# Altium schematic sheet MCU.SchDoc
size A4
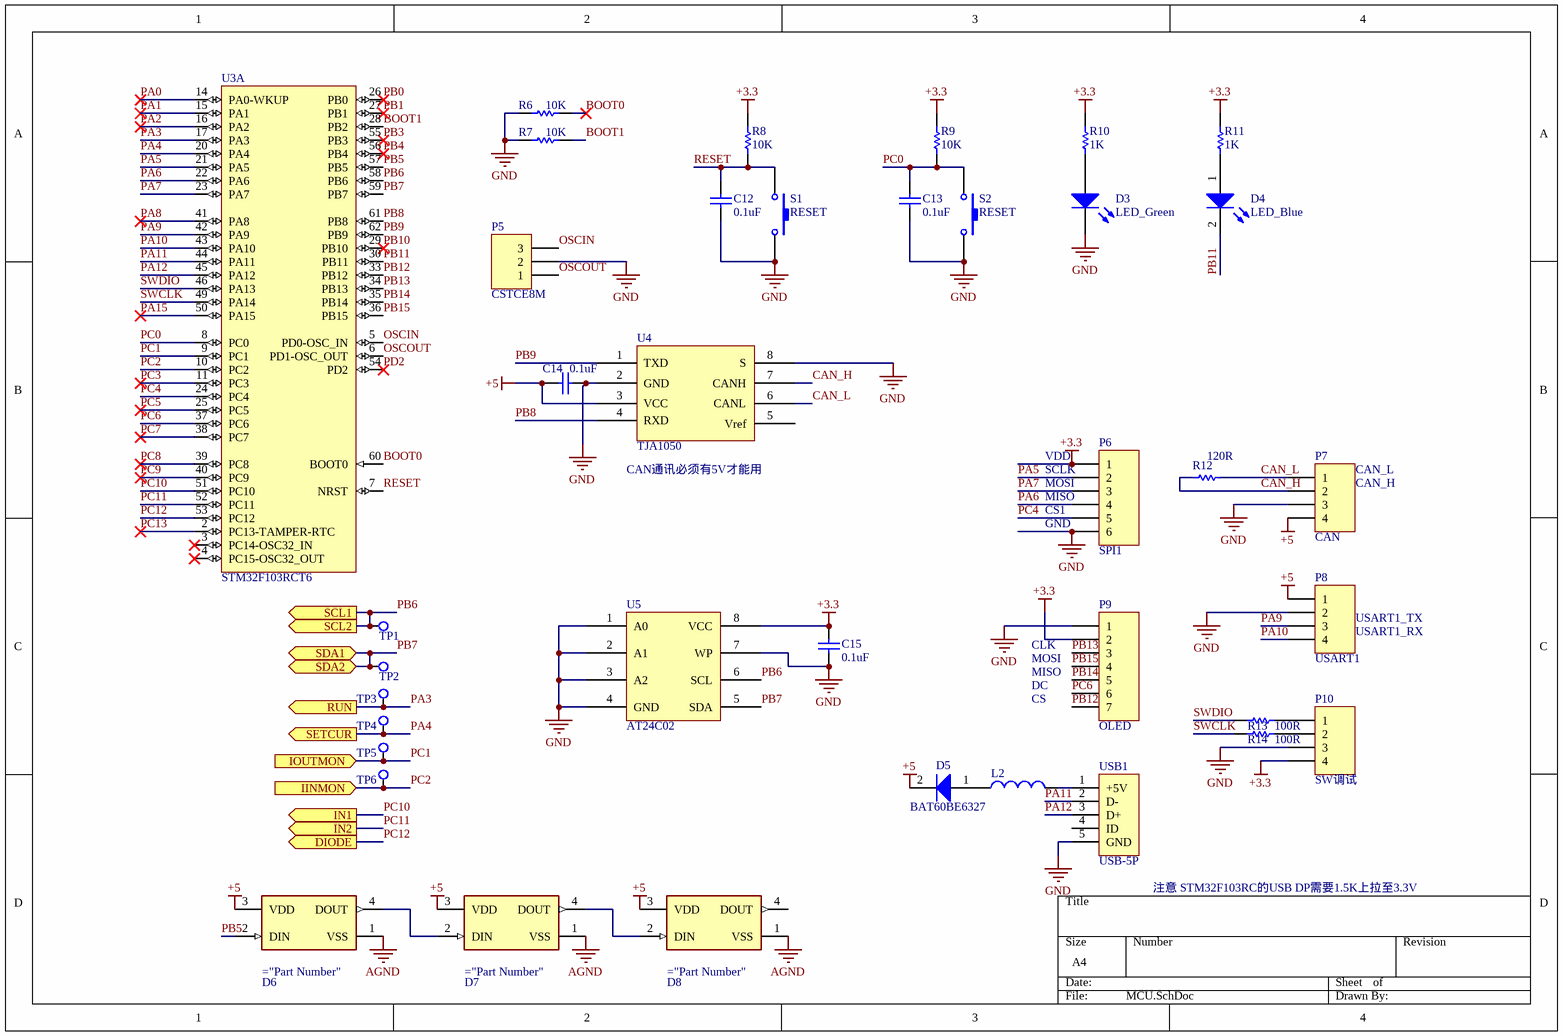
[diagram p0: MCU.SchDoc]

## Parts
C12  value 0.1uF  [0603C]  (hidden comment: Cap)
C13  value 0.1uF  [0603C]  (hidden comment: Cap)
C14  value 0.1uF  [0603C]  (hidden comment: Cap)
C15  value 0.1uF  [0603C]  (hidden comment: Cap)
D3  LED_Green  [LED 0603B]
D4  LED_Blue  [LED 0603B]
D5  BAT60BE6327  [SOD-523]
D6  WS2812  [Adafruit_1655_0]  (value not drawn)
D7  WS2812  [Adafruit_1655_0]  (value not drawn)
D8  WS2812  [Adafruit_1655_0]  (value not drawn)
L2  Inductor  [L 0603]  (value not drawn)
P5  CSTCE8M  [CSTCE16M]
P6  SPI1  [MX 1.25-WS-6P]
P7  CAN  [SM04B]
P8  USART1  [SM04B]
P9  OLED  [HDR2.54-M-LI-7P]
P10  SW调试  [53261]
R6  value 10K  [0603R]  (hidden comment: Res1)
R7  value 10K  [0603R]  (hidden comment: Res1)
R8  value 10K  [0603R]  (hidden comment: Res1)
R9  value 10K  [0603R]  (hidden comment: Res1)
R10  value 1K  [0603R]  (hidden comment: Res1)
R11  value 1K  [0603R]  (hidden comment: Res1)
R12  value 120R  [0603R]  (hidden comment: Res1)
R13  value 100R  [0603R]  (hidden comment: Res1)
R14  value 100R  [0603R]  (hidden comment: Res1)
S1  RESET  [TSW SMD-3*6*2.5]
S2  RESET  [TSW SMD-3*6*2.5]
TP1  TestPoint  [TP_Black(1.6mm)]  (value not drawn)
TP2  TestPoint  [TP_Black(1.6mm)]  (value not drawn)
TP3  TestPoint  [TP_Black(1.6mm)]  (value not drawn)
TP4  TestPoint  [TP_Black(1.6mm)]  (value not drawn)
TP5  TestPoint  [TP_Black(1.6mm)]  (value not drawn)
TP6  TestPoint  [TP_Black(1.6mm)]  (value not drawn)
U3  STM32F103RCT6  [STM-LQFP64_N]  (part A of 2)
U4  TJA1050  [SO8]
U5  AT24C02  [SOP8]
USB1  USB-5P  [USB-MICRO_E]

## Ports
DIODE (out), IINMON (in), IN1 (out), IN2 (out), IOUTMON (in), RUN (out), SCL1 (out), SCL2 (out), SDA1 (bidir), SDA2 (bidir), SETCUR (out)

## Nets
+3.3: C15.1 P6.1 P9.2 P10.4 R8.2 R9.2 R10.2 R11.2 U5.8(VCC)
+5: C14.2 D5.2(K) D6.3(VDD) D7.3(VDD) D8.3(VDD) P7.4 P8.1 U4.3(VCC)
AGND: D6.1(VSS) D7.1(VSS) D8.1(VSS)
GND: C12.1 C13.1 C14.1 C15.2 D3.2(K) P5.2 P6.6 P7.3 P8.2 P9.1 P10.3 R6.1 R7.1 S1.2 S2.2 U4.2(GND) U4.8(S) U5.1(A0) U5.2(A1) U5.3(A2) U5.4(GND) U5.7(WP) USB1.5(GND)
BOOT0: R6.2 U3.60(BOOT0)
BOOT1: R7.2 U3.28(PB2)
CAN_H: P7.2 R12.1 U4.7(CANH)
CAN_L: P7.1 R12.2 U4.6(CANL)
OSCIN: P5.3 U3.5(PD0-OSC_IN)
OSCOUT: P5.1 U3.6(PD1-OSC_OUT)
PA0: U3.14(PA0-WKUP)
PA1: U3.15(PA1)
PA2: U3.16(PA2)
PA3: TP3.1(VSS) U3.17(PA3) ; port RUN
PA4: TP4.1(VSS) U3.20(PA4) ; port SETCUR
PA5: P6.2 U3.21(PA5)
PA6: P6.4 U3.22(PA6)
PA7: P6.3 U3.23(PA7)
PA8: U3.41(PA8)
PA9: P8.3 U3.42(PA9)
PA10: P8.4 U3.43(PA10)
PA11: U3.44(PA11) USB1.2(D-)
PA12: U3.45(PA12) USB1.3(D+)
PA15: U3.50(PA15)
PB0: U3.26(PB0)
PB1: U3.27(PB1)
PB3: U3.55(PB3)
PB4: U3.56(PB4)
PB5: D6.2(DIN) U3.57(PB5)
PB6: TP1.1(VSS) U3.58(PB6) U5.6(SCL) ; port SCL2, port SCL1
PB7: TP2.1(VSS) U3.59(PB7) U5.5(SDA) ; port SDA1, port SDA2
PB8: U3.61(PB8) U4.4(RXD)
PB9: U3.62(PB9) U4.1(TXD)
PB10: U3.29(PB10)
PB11: D4.2(K) U3.30(PB11)
PB12: P9.7 U3.33(PB12)
PB13: P9.3 U3.34(PB13)
PB14: P9.5 U3.35(PB14)
PB15: P9.4 U3.36(PB15)
PC0: C13.2 R9.1 S2.1 U3.8(PC0)
PC1: TP5.1(VSS) U3.9(PC1) ; port IOUTMON
PC2: TP6.1(VSS) U3.10(PC2) ; port IINMON
PC3: U3.11(PC3)
PC4: P6.5 U3.24(PC4)
PC5: U3.25(PC5)
PC6: P9.6 U3.37(PC6)
PC7: U3.38(PC7)
PC8: U3.39(PC8)
PC9: U3.40(PC9)
PC10: U3.51(PC10) ; port IN1
PC11: U3.52(PC11) ; port IN2
PC12: U3.53(PC12) ; port DIODE
PC13: U3.2(PC13-TAMPER-RTC)
PD2: U3.54(PD2)
RESET: C12.2 R8.1 S1.1 U3.7(NRST)
SWCLK: R14.1 U3.49(PA14)
SWDIO: R13.1 U3.46(PA13)
NetD3_1: D3.1(A) R10.1
NetD4_1: D4.1(A) R11.1
NetD5_1: D5.1(A) L2.1
NetD6_4: D6.4(DOUT) D7.2(DIN)
NetD7_4: D7.4(DOUT) D8.2(DIN)
NetL2_2: L2.2 USB1.1(+5V)
NetP10_1: P10.1 R13.2
NetP10_2: P10.2 R14.2

Not connected (* = marked no-connect by the designer): D8 4(DOUT); U3 3(PC14-OSC32_IN)* 4(PC15-OSC32_OUT)*; U4 5(Vref); USB1 4(ID)

## Notes on the sheet
- (near U4) CAN通讯必须有5V才能用
- (near P6) VDD
- (near P6) SCLK
- (near P6) MOSI
- (near P6) MISO
- (near P6) CS1
- (near P7) CAN_L
- (near P7) CAN_H
- (near P6) GND
- (near P9) CLK
- (near P8) USART1_TX
- (near P8) USART1_RX
- CS
- DC
- (near P9) MISO
- (near P9) MOSI
- 注意 STM32F103RC的USB DP需要1.5K上拉至3.3V

## Library data of the parts
C12-C15 = Cap: X5R 50V; Published: 8-Jun-2000; LatestRevisionDate: 17-Jul-2002; LatestRevisionNote: Re-released for DXP Platform.; PackageReference: RAD-0.3; Publisher: Altium Limited; PackageDescription: Radial Cap, Thru-Hole; 2 Leads; 0.3 in Pin Spacing
D3 = LED0: Green; Published: 8-Jun-2000; LatestRevisionDate: 08-Jul-2005; LatestRevisionNote: Mech Layer 1 removed.; PackageReference: LED-0; Publisher: Altium Limited; PackageDescription: LED; 2 Leads
D4 = LED0: Blue; Published: 8-Jun-2000; LatestRevisionDate: 08-Jul-2005; LatestRevisionNote: Mech Layer 1 removed.; PackageReference: LED-0; Publisher: Altium Limited; PackageDescription: LED; 2 Leads
D5 = Diode: Published: 8-Jun-2000; LatestRevisionDate: 17-Jul-2002; LatestRevisionNote: Re-released for DXP Platform.; PackageVersion: Sep-1996; PackageReference: SMC; Publisher: Altium Limited; PackageDescription: DO-214-AB/SMC; 2 C-Bend Leads; Body 7.9 x 5.9 mm, inc. leads (LxW); Code_JEDEC: DO-214-AB
D6-D8 = WS2812: RGB LED
L2 = Inductor: MPZ1608S181ATAH0; Code_IEC: 1005; Value: mH; Published: 8-Jun-2000; LatestRevisionDate: 29-May-2009; LatestRevisionNote: IPC-7351 Footprint Added.; PackageReference: 0402-A; Publisher: Altium Limited; PackageDescription: Chip Inductor; Code_JEITA: 0402
P5 = Header 3: Header, 3-Pin; LatestRevisionDate: 17-Jul-2002; LatestRevisionNote: Re-released for DXP Platform.; Publisher: Altium Limited
P6 = Header 6: Header, 6-Pin; LatestRevisionDate: 17-Jul-2002; LatestRevisionNote: Re-released for DXP Platform.; Publisher: Altium Limited
P7 P8 = Header 4: Header, 4-Pin; LatestRevisionDate: 17-Jul-2002; LatestRevisionNote: Re-released for DXP Platform.; Publisher: Altium Limited
P9 = Header 7: OLED Connector 7P杜邦母头; LatestRevisionDate: 17-Jul-2002; LatestRevisionNote: Re-released for DXP Platform.; Publisher: Altium Limited
P10 = Header 4: Connector MX1.25 4P; LatestRevisionDate: 17-Jul-2002; LatestRevisionNote: Re-released for DXP Platform.; Publisher: Altium Limited
R6-R14 = Res1: Resistor; Published: 8-Jun-2000; LatestRevisionDate: 17-Jul-2002; LatestRevisionNote: Re-released for DXP Platform.; PackageReference: AXIAL-0.3; Publisher: Altium Limited; PackageDescription: Axial Device, Thru-Hole; 2 Leads; 0.3 in Pin Spacing
S1 S2 = SW-PB: Switch; Published: 24-Mar-1999; LatestRevisionDate: 17-Jul-2002; LatestRevisionNote: Re-released for DXP Platform.; PackageReference: SPST-2; Publisher: Altium Limited; PackageDescription: Switch; 2 Leads
TP1-TP6 = TestPoint: PCB测试点
U3 = STM32F103RCT6: ARM Cortex-M3 32-bit MCU, 256 KB Flash, 48 KB Internal RAM, 51 I/Os, 64-pin LQFP, -40 to 85 degC, Tray; A/D Converter: 3x12-bit (16 Channel); D/A Converter: 2x12-bit (2 Channel); FLASH Size (Prog) (kB): 256; I/Os (High Current): 51; Internal RAM Size (kB): 48; Operating Frequency(F) (Processor speed) (MHz): 72; Supply Voltage(Vcc) min (V): 2; DatasheetVersion: Rev. 8; PackageVersion: Rev. 4, 06/2013; PackageReference: LQFP64; PackageDescription: 64-Pin Low Profile Quad Flat Package, 10 x 10 mm Body, 0.5 mm Pitch; Supplier 1: Digi-Key; Supplier Part Number 1: 497-9033-ND; Supplier 2: Newark; Supplier Part Number 2: 01P4099; Supplier 3: Newark; Supplier Part Number 3: 57P1227; Supplier 4: Mouser; Supplier Part Number 4: 511-STM32F103RCT6; Core: ARM Cortex-M3; Packing: Tray; Mounting Technology: Surface Mount; PartNumber: STM32F103RCT6; ComponentLink1Description: Manufacturer URL; ComponentLink1URL: http://www.st.com/web/en/home.html; ComponentLink2Description: Datasheet; ComponentLink2URL: http://www.st.com/st-web-ui/static/active/en/resource/technical/document/datasheet/CD00191185.pdf; ComponentLink3Description: Package Specification; ComponentLink3URL: http://www.st.com/st-web-ui/static/active/en/resource/technical/document/datasheet/DM00037051.pdf
U4 = TJA1050: CAN收发器
USB1 = USB-5P: 微型USB母座; 版权归属: 源创客; BOM名称: 微型USB母座; 学习资源: www.ooocke.com